# Altium schematic sheet FxxVx.SchDoc
size A2
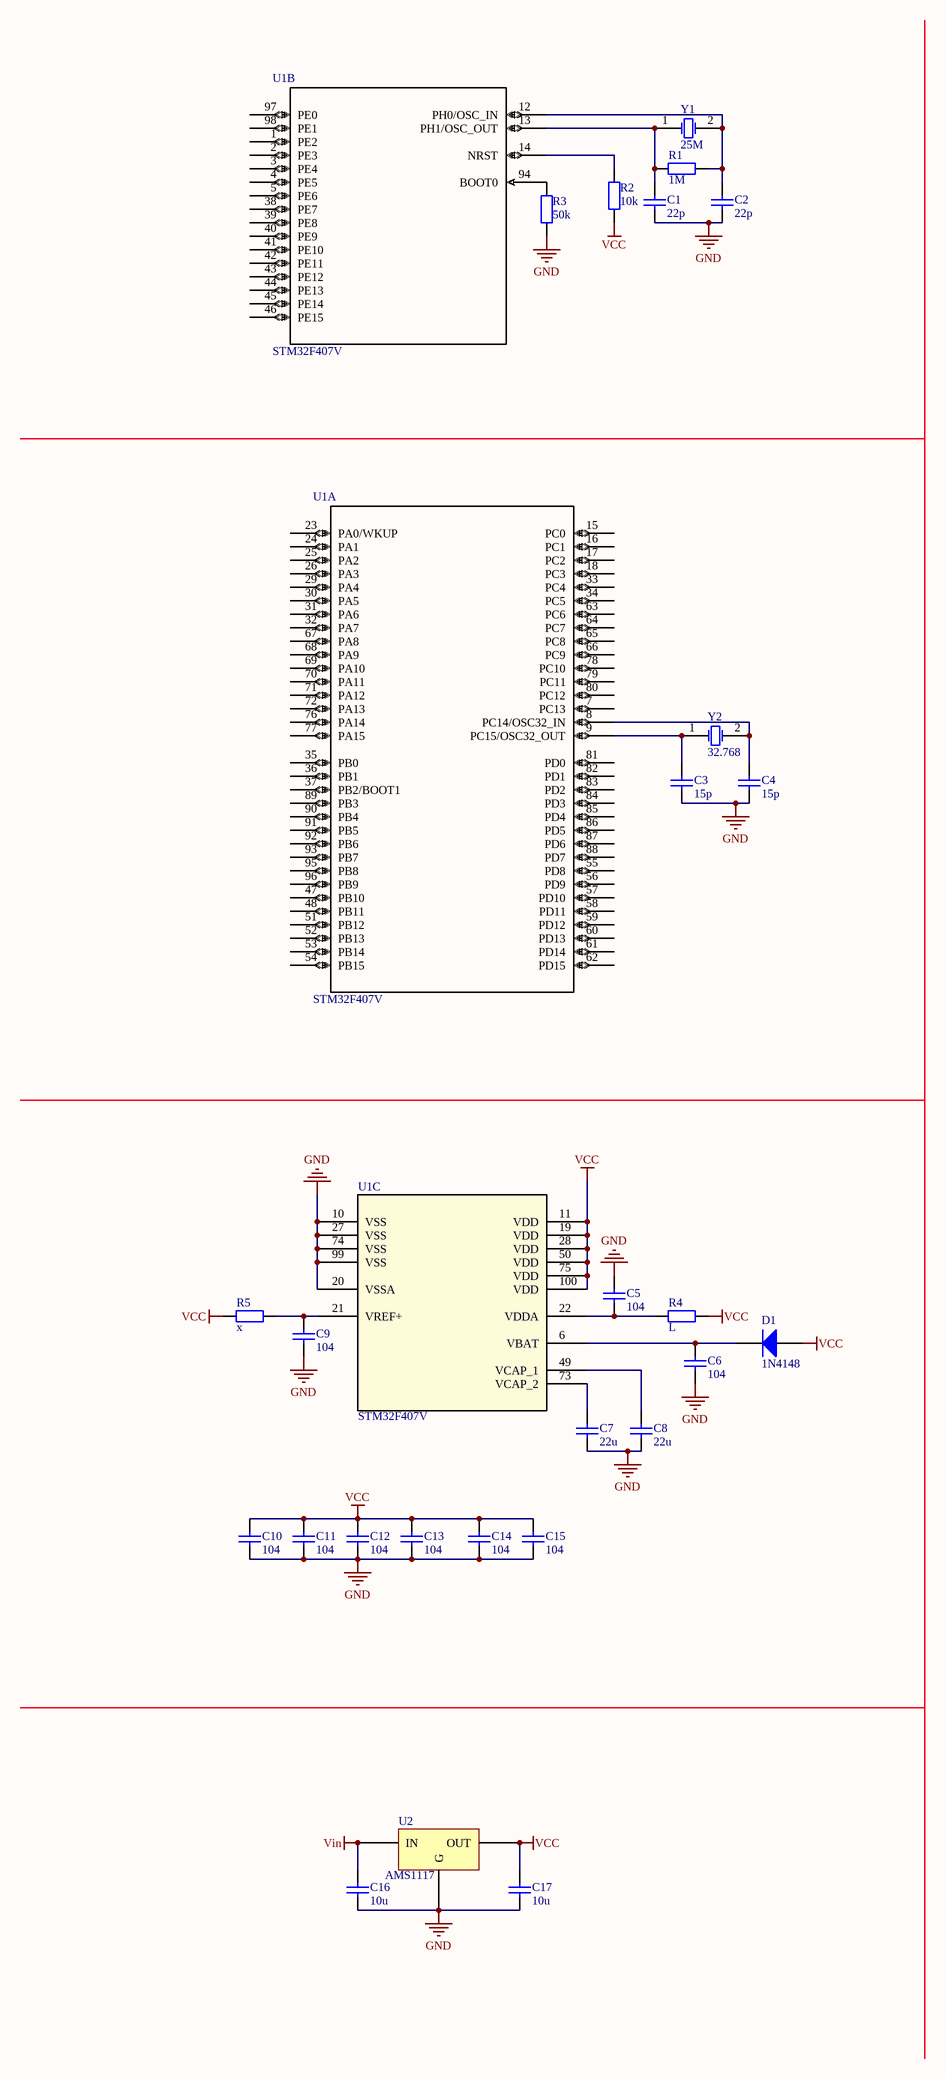
[diagram p0: FxxVx.SchDoc]

## Parts
C1  22p  [0603]
C2  22p  [0603]
C3  15p  [0603]
C4  15p  [0603]
C5  104  [0603]
C6  104  [0603]
C7  22u  [0603]
C8  22u  [0603]
C9  104  [0603]
C10  104  [0603]
C11  104  [0603]
C12  104  [0603]
C13  104  [0603]
C14  104  [0603]
C15  104  [0603]
C16  10u  [0603]
C17  10u  [0603]
D1  1N4148  [0603]
R1  1M  [0603]
R2  10k  [0603]
R3  50k  [0603]
R4  L  [0603]
R5  x  [0603]
U1  STM32F407V  [LQFP100-14x14mm]  (parts A,B,C of 3)
U2  AMS1117
Y1  25M  [3225-4]
Y2  32.768  [3215-2]

## Nets
GND: C1.1 C2.1 C3.1 C4.1 C5.2 C6.1 C7.1 C8.1 C9.1 C10.1 C11.1 C12.1 C13.1 C14.1 C15.1 C16.1 C17.1 R3.1 U1.10(VSS) U1.20(VSSA) U1.27(VSS) U1.74(VSS) U1.99(VSS) U2.1(G)
VCC: C10.2 C11.2 C12.2 C13.2 C14.2 C15.2 C17.2 D1.1(A) R2.1 R4.1 R5.2 U1.11(VDD) U1.19(VDD) U1.28(VDD) U1.50(VDD) U1.75(VDD) U1.100(VDD) U2.2(OUT)
Vin: C16.2 U2.3(IN)
NetC1_2: C1.2 R1.1 U1.13(PH1/OSC_OUT) Y1.1(OSC1)
NetC2_2: C2.2 R1.2 U1.12(PH0/OSC_IN) Y1.2(OSC2)
NetC3_2: C3.2 U1.9(PC15/OSC32_OUT) Y2.1(OSC1)
NetC4_2: C4.2 U1.8(PC14/OSC32_IN) Y2.2(OSC2)
NetC5_1: C5.1 R4.2 U1.22(VDDA)
NetC6_2: C6.2 D1.2(K) U1.6(VBAT)
NetC7_2: C7.2 U1.73(VCAP_2)
NetC8_2: C8.2 U1.49(VCAP_1)
NetC9_2: C9.2 R5.1 U1.21(VREF+)
NetR2_2: R2.2 U1.14(NRST)
NetR3_2: R3.2 U1.94(BOOT0)

Not connected (* = marked no-connect by the designer): U1 1(PE2) 2(PE3) 3(PE4) 4(PE5) 5(PE6) 7(PC13) 15(PC0) 16(PC1) 17(PC2) 18(PC3) 23(PA0/WKUP) 24(PA1) 25(PA2) 26(PA3) 29(PA4) 30(PA5) 31(PA6) 32(PA7) 33(PC4) 34(PC5) 35(PB0) 36(PB1) 37(PB2/BOOT1) 38(PE7) 39(PE8) 40(PE9) 41(PE10) 42(PE11) 43(PE12) 44(PE13) 45(PE14) 46(PE15) 47(PB10) 48(PB11) 51(PB12) 52(PB13) 53(PB14) 54(PB15) 55(PD8) 56(PD9) 57(PD10) 58(PD11) 59(PD12) 60(PD13) 61(PD14) 62(PD15) 63(PC6) 64(PC7) 65(PC8) 66(PC9) 67(PA8) 68(PA9) 69(PA10) 70(PA11) 71(PA12) 72(PA13) 76(PA14) 77(PA15) 78(PC10) 79(PC11) 80(PC12) 81(PD0) 82(PD1) 83(PD2) 84(PD3) 85(PD4) 86(PD5) 87(PD6) 88(PD7) 89(PB3) 90(PB4) 91(PB5) 92(PB6) 93(PB7) 95(PB8) 96(PB9) 97(PE0) 98(PE1)

## Notes on the sheet
- Title
- Size:
- Date:
- File:
- A2
- Number:
- Time:
- Revision:
- Sheet
- of

## Library data of the parts
C1-C17 = C: Capacitor; Published: 8-Jun-2000; LatestRevisionDate: 17-Jul-2002; LatestRevisionNote: Re-released for DXP Platform.; PackageReference: RAD-0.3; Publisher: Altium Limited; PackageDescription: Radial Cap, Thru-Hole; 2 Leads; 0.3 in Pin Spacing
D1 = D: Diode; Published: 8-Jun-2000; LatestRevisionDate: 17-Jul-2002; LatestRevisionNote: Re-released for DXP Platform.; PackageVersion: Sep-1996; PackageReference: SMC; Publisher: Altium Limited; PackageDescription: DO-214-AB/SMC; 2 C-Bend Leads; Body 7.9 x 5.9 mm, inc. leads (LxW); Code_JEDEC: DO-214-AB
R1-R5 = R: Resistor; Published: 8-Jun-2000; LatestRevisionDate: 17-Jul-2002; LatestRevisionNote: Re-released for DXP Platform.; PackageReference: AXIAL-0.4; Publisher: Altium Limited; PackageDescription: Axial Device, Thru-Hole; 2 Leads; 0.4 in Pin Spacing
U1 = STM32F407V: Imported; Manufacturer_Part_Number: stm32f4xxv2; Vendor: STMicroelectronics; C: Copyright (C) 2016 Accelerated Designs. All rights reserved; Copyright: Copyright (C) 2016 Accelerated Designs. All rights reserved; RefDes: RefDes; Type: Type; Value: Value
Y1 = XTAL: Crystal Oscillator; pin to pad: 2>3; Published: 8-Jun-2000; LatestRevisionDate: 17-Jul-2002; LatestRevisionNote: Re-released for DXP Platform.; Publisher: Altium Limited
Y2 = XTAL: Crystal Oscillator; Published: 8-Jun-2000; LatestRevisionDate: 17-Jul-2002; LatestRevisionNote: Re-released for DXP Platform.; Publisher: Altium Limited